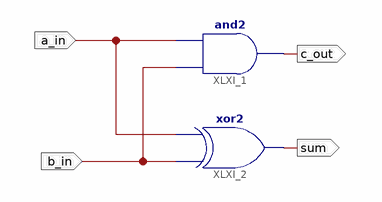
[diagram p0: schematic sheet 1]
// Xilinx ISE schematic half_adder.sch (spartan3) as structural Verilog: 2 symbols, 4 ports
module half_adder (
  input  a_in,
  input  b_in,
  output c_out,
  output sum
);

  and XLXI_1 (c_out, b_in, a_in);
  xor XLXI_2 (sum, b_in, a_in);
endmodule
